# EAGLE design brainboard (EAGLE 5.10)
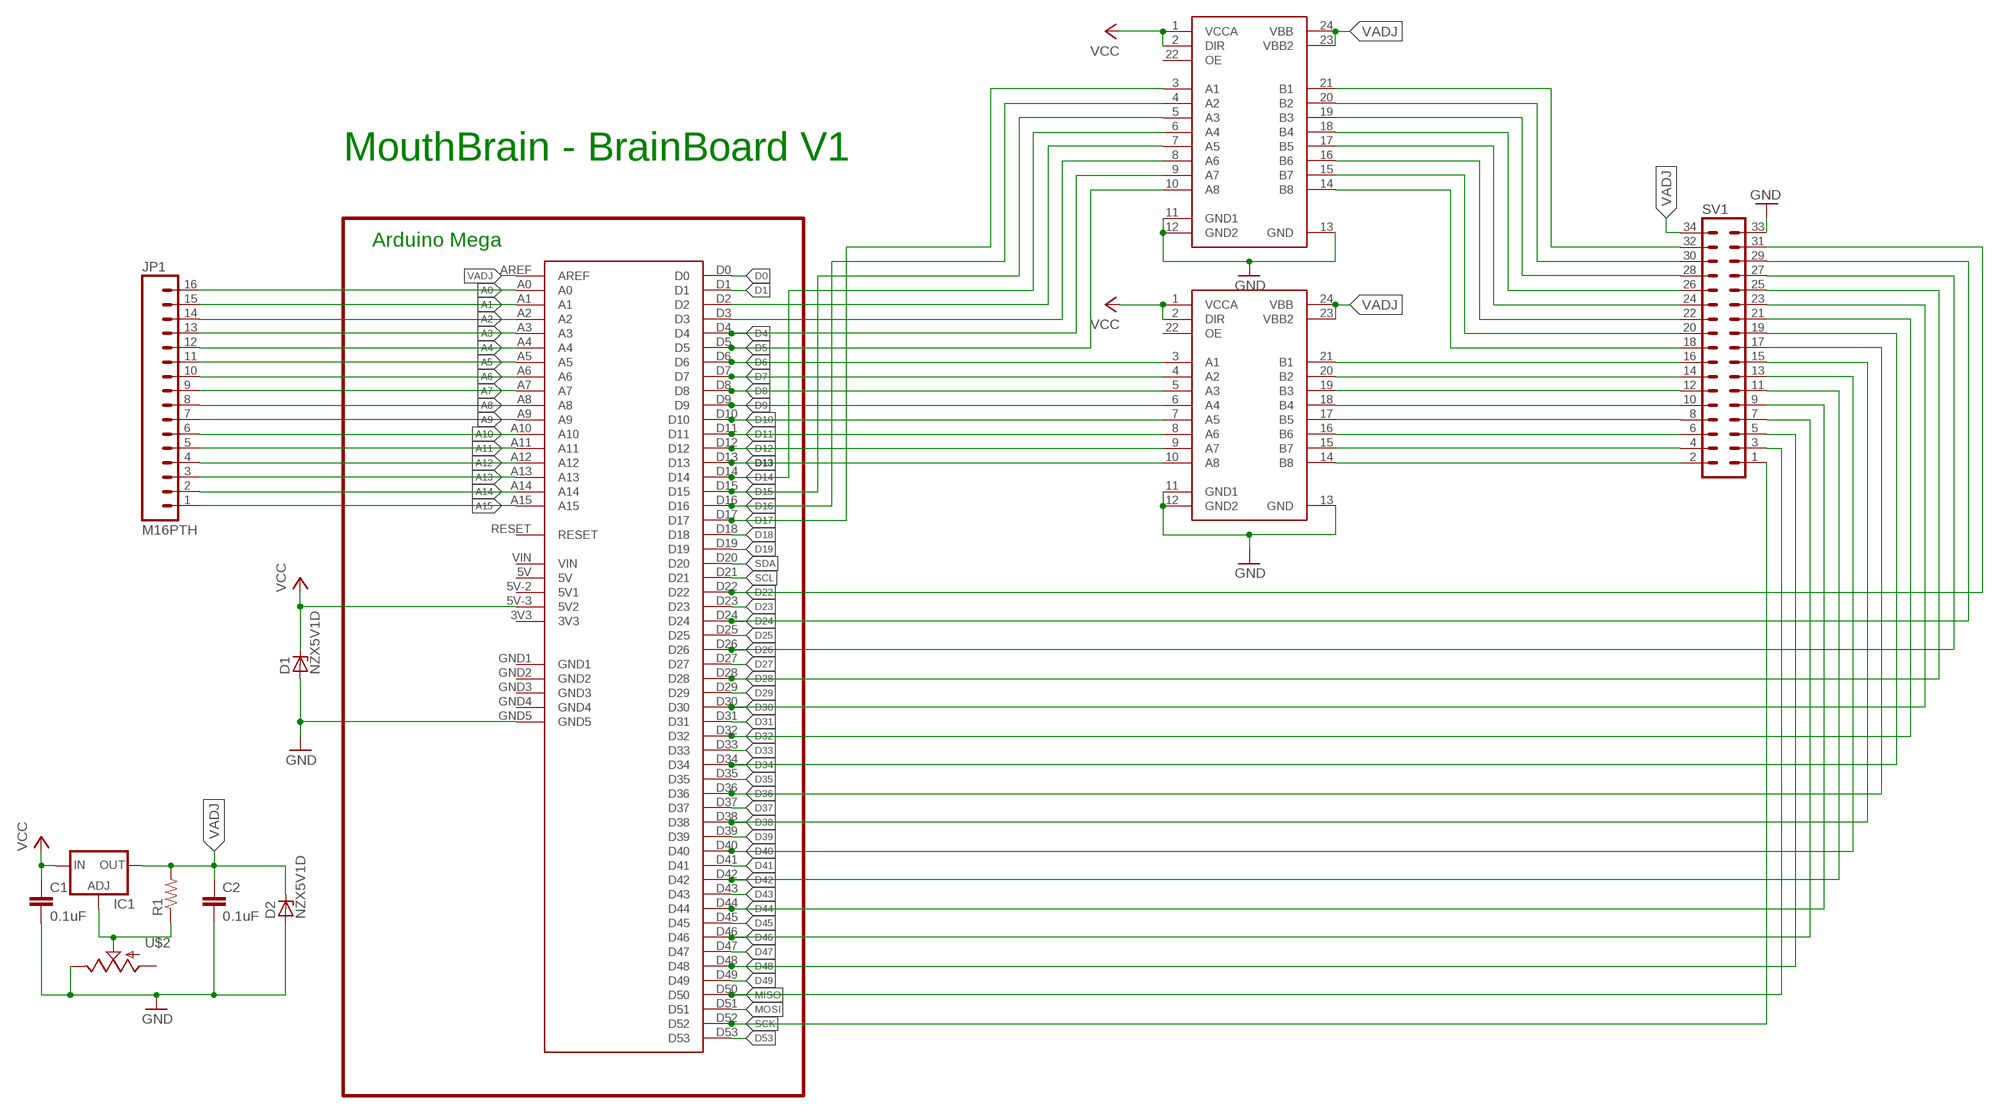
[diagram p0: schematic, sheet 1]

## Parts
C1  0.1uF  CAPPTH  [CAP-PTH-SMALL]
C2  0.1uF  CAPPTH  [CAP-PTH-SMALL]
D1  NZX5V1D  ZENER-DIODEDO34-7  [DO34Z7]
D2  NZX5V1D  ZENER-DIODEDO34-7  [DO34Z7]
DW1  SN74LVC8T245  [SO24W]
DW2  SN74LVC8T245  [SO24W]
IC1  LM317L  [317L]
JP1  M16PTH  [1X16]
R1  RESISTORPTH1  [AXIAL-0.3]
SV1  ML34  [ML34]
U$1  ARDUINO-MEGA  [ARDUINO-MEGA]
U$2  POTPTV09A-4  [PTV09A-4]

## Nets
A0: JP1.16 U$1.A0
A1: JP1.15 U$1.A1
A2: JP1.14 U$1.A2
A3: JP1.13 U$1.A3
A4: JP1.12 U$1.A4
A5: JP1.11 U$1.A5
A6: JP1.10 U$1.A6
A7: JP1.9 U$1.A7
A8: JP1.8 U$1.A8
A9: JP1.7 U$1.A9
A10: JP1.6 U$1.A10
A11: JP1.5 U$1.A11
A12: JP1.4 U$1.A12
A13: JP1.3 U$1.A13
A14: JP1.2 U$1.A14
A15: JP1.1 U$1.A15
D0: U$1.D0
D1: U$1.D1
D4: DW2.9(A7) U$1.D4
D5: DW2.10(A8) U$1.D5
D6: DW1.3(A1) U$1.D6
D7: DW1.4(A2) U$1.D7
D8: DW1.5(A3) U$1.D8
D9: DW1.6(A4) U$1.D9
D10: DW1.7(A5) U$1.D10
D11: DW1.8(A6) U$1.D11
D12: DW1.9(A7) U$1.D12
D13: DW1.10(A8) U$1.D13
D14: DW2.6(A4) U$1.D14
D15: DW2.5(A3) U$1.D15
D16: DW2.4(A2) U$1.D16
D17: DW2.3(A1) U$1.D17
D18: U$1.D18
D19: U$1.D19
D22: SV1.31 U$1.D22
D23: U$1.D23
D24: SV1.29 U$1.D24
D25: U$1.D25
D26: SV1.27 U$1.D26
D27: U$1.D27
D28: SV1.25 U$1.D28
D29: U$1.D29
D30: SV1.23 U$1.D30
D31: U$1.D31
D32: SV1.21 U$1.D32
D33: U$1.D33
D34: SV1.19 U$1.D34
D35: U$1.D35
D36: SV1.17 U$1.D36
D37: U$1.D37
D38: SV1.15 U$1.D38
D39: U$1.D39
D40: SV1.13 U$1.D40
D41: U$1.D41
D42: SV1.11 U$1.D42
D43: U$1.D43
D44: SV1.9 U$1.D44
D45: U$1.D45
D46: SV1.7 U$1.D46
D47: U$1.D47
D48: SV1.5 U$1.D48
D49: U$1.D49
D53: U$1.D53
GND: C1.2 C2.2 D1.A D2.A DW1.11(GND1) DW1.12(GND2) DW1.13(GND) DW2.11(GND1) DW2.12(GND2) DW2.13(GND) SV1.33 U$1.GND5 U$2.1(E)
MISO: SV1.3 U$1.D50
MOSI: U$1.D51
N$1: DW2.8(A6) U$1.D3
N$2: DW2.7(A5) U$1.D2
N$3: DW1.14(B8) SV1.2
N$4: IC1.1(ADJ) R1.P$1 U$2.2(S)
N$5: DW1.15(B7) SV1.4
N$6: DW1.16(B6) SV1.6
N$7: DW1.17(B5) SV1.8
N$8: DW2.14(B8) SV1.18
N$9: DW1.18(B4) SV1.10
N$10: DW1.19(B3) SV1.12
N$11: DW1.20(B2) SV1.14
N$12: DW2.15(B7) SV1.20
N$13: DW1.21(B1) SV1.16
N$14: DW2.16(B6) SV1.22
N$15: DW2.17(B5) SV1.24
N$16: DW2.18(B4) SV1.26
N$17: DW2.19(B3) SV1.28
N$18: DW2.20(B2) SV1.30
N$20: DW2.21(B1) SV1.32
SCK: SV1.1 U$1.D52
SCL: U$1.D21
SDA: U$1.D20
VADJ: C2.1 D2.C DW1.23(VBB2) DW1.24(VBB) DW2.23(VBB2) DW2.24(VBB) IC1.2(OUT) R1.P$2 SV1.34 U$1.AREF
VCC: C1.1 D1.C DW1.1(VCCA) DW1.2(DIR) DW2.1(VCCA) DW2.2(DIR) IC1.3(IN) U$1.5V-3(5V2)
Unconnected: DW1.22(OE) DW2.22(OE) U$1.3V3 U$1.5V U$1.5V-2(5V1) U$1.GND1 U$1.GND2 U$1.GND3 U$1.GND4 U$1.RESET U$1.VIN U$2.3(A)

## Notes on the sheet
- MouthBrain - BrainBoard V1
- Arduino Mega

## Library data of the parts
C1 C2 = SparkFun:CAP: Capacitor Standard 0603 ceramic capacitor, and 0.1" leaded capacitor.
D1 D2 = diode:ZENER-DIODE: Z-Diode
DW1 DW2 = Hoeken:SN74LVC8T245
IC1 = v-reg:LM317L: VOLTAGE REGULATOR
JP1 = SparkFun:M16
R1 = SparkFun:RESISTOR: Resistor Basic schematic elements and footprints for 0603, 1206, and PTH 1/10th watt (small) resistors.
SV1 = con-ml:ML34: HARTING
U$1 = MakerBot:ARDUINO-MEGA
U$2 = Hoeken:POT

## Net classes
0 default: width 0.254 mm, drill 0.508 mm, clearance 0.254 mm
1 power: width 0.61 mm, drill 0.711 mm, clearance 0.203 mm
2 gnd: width 0.305 mm, drill 0.711 mm, clearance 0.203 mm
3 usbvcc: width 0.508 mm, drill 0.711 mm, clearance 0.203 mm

## Board
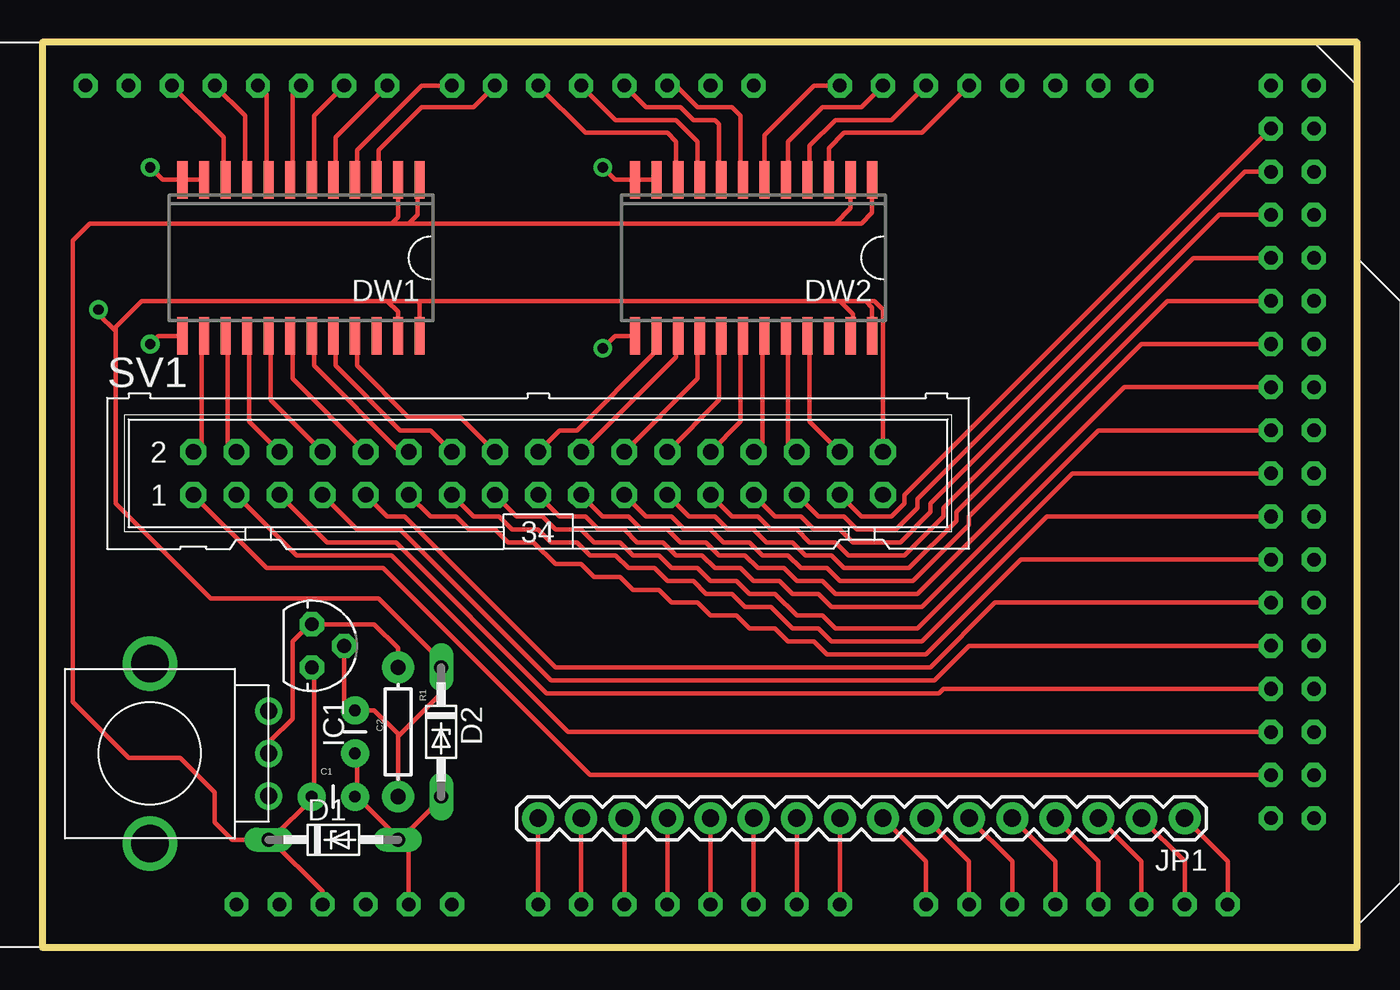
[diagram p1: board, top side]
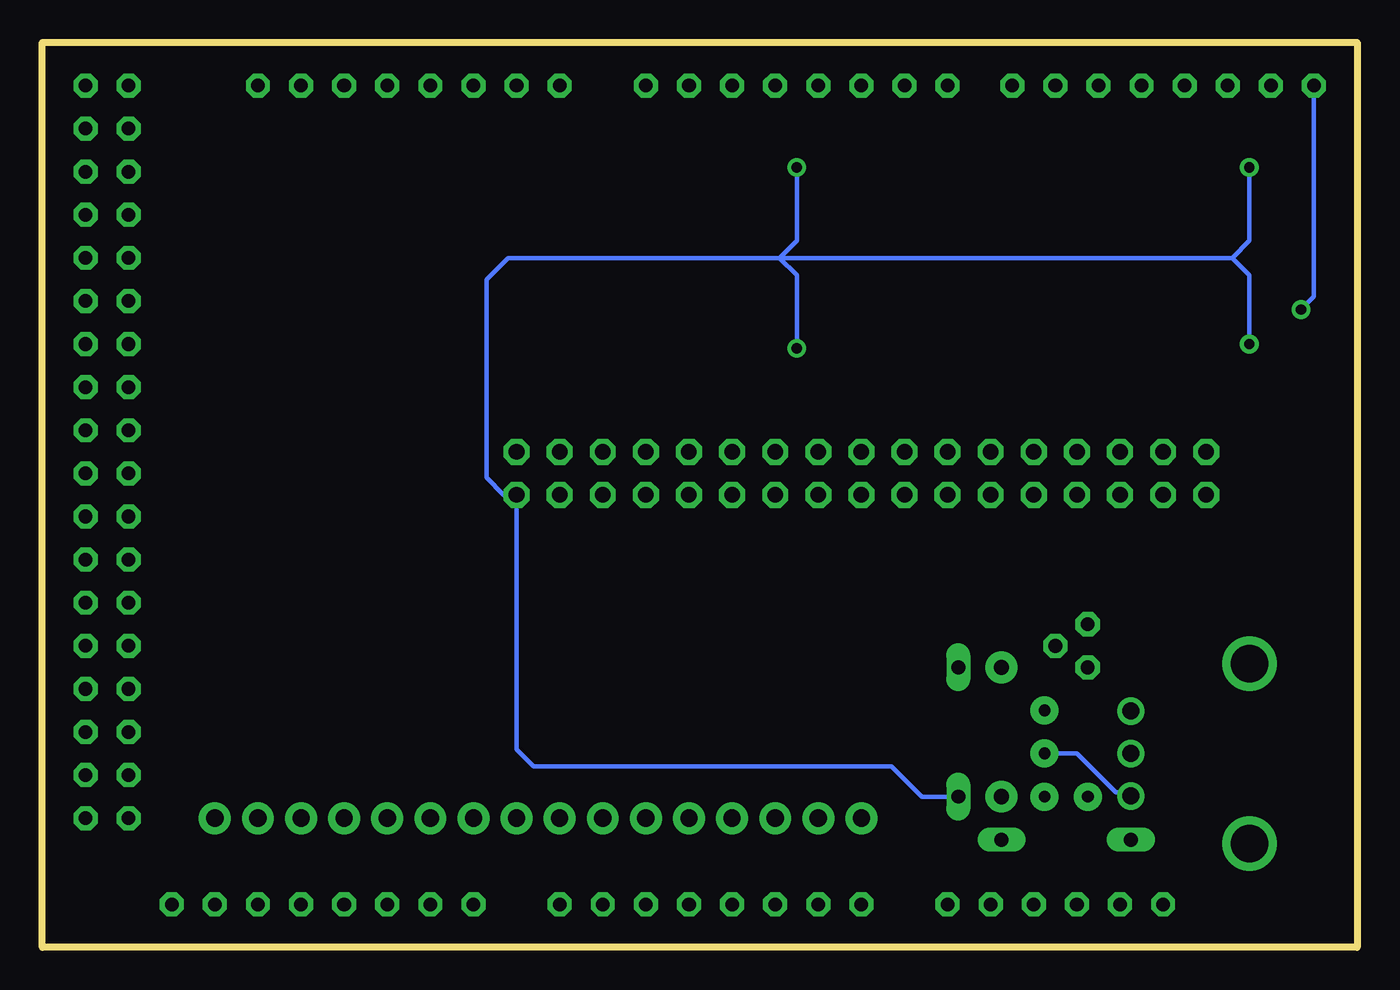
[diagram p2: board, bottom side, seen from below]

Size 77.47 x 53.34 mm. Coordinates in mm from the lower left corner, seen from the top.
Outline: 0,0 77.47,0 77.47,53.34 0,53.34 0,0
Copper layers (1*16): Top 0.035mm / dielectric 1.5mm / Bottom 0.035mm
Design rules "SparkFun *": minimum track width 8mil, minimum drill 20mil, track to track 12mil, track to pad 12mil, pad to pad 12mil, via to via 12mil, smd to smd 12mil, copper to edge 10mil, drill to drill 8mil, minimum pad ring 12mil, minimum via ring 10mil, stop-mask expansion 4mil, vias tented up to drill 25mil, thermal gap 10mil
tRestrict: area 73,7 to 74.3,51.4; area 8.3,27.3 to 50.2,28.6
bRestrict: area 8.3,27.3 to 50.2,28.6; area 73,7 to 74.3,51.4

### Footprints (pad centres in the part's own frame; a part is rotated, then mirrored left to right if it is on the bottom)
CAP-PTH-SMALL = drill 0.7 pad 1.651 round: 1 0,0; 2 2.54,0
DO34Z7 = drill 0.813 long: A 3.81,0; C -3.81,0
SO24W = smd 0.6 x 2.2: 1 -6.985,-4.6; 2 -5.715,-4.6; 3 -4.445,-4.6; 4 -3.175,-4.6; 5 -1.905,-4.6; 6 -0.635,-4.6; 7 0.635,-4.6; 8 1.905,-4.6; 9 3.175,-4.6; 10 4.445,-4.6; 11 5.715,-4.6; 12 6.985,-4.6; 13 6.985,4.6; 14 5.715,4.6; 15 4.445,4.6; 16 3.175,4.6; 17 1.905,4.6; 18 0.635,4.6; 19 -0.635,4.6; 20 -1.905,4.6; 21 -3.175,4.6; 22 -4.445,4.6; 23 -5.715,4.6; 24 -6.985,4.6
317L = drill 0.813 octagon: 1 -1.27,0; 2 0,1.905; 3 1.27,0
1X16 = drill 1.016 pad 1.88 round: 1 0,0; 2 2.54,0; 3 5.08,0; 4 7.62,0; 5 10.16,0; 6 12.7,0; 7 15.24,0; 8 17.78,0; 9 20.32,0; 10 22.86,0; 11 25.4,0; 12 27.94,0; 13 30.48,0; 14 33.02,0; 15 35.56,0; 16 38.1,0
AXIAL-0.3 = drill 0.9 pad 1.88 round: P$1 -3.81,0; P$2 3.81,0
ML34 = drill 0.914 octagon: 1 -20.32,-1.27; 2 -20.32,1.27; 3 -17.78,-1.27; 4 -17.78,1.27; 5 -15.24,-1.27; 6 -15.24,1.27; 7 -12.7,-1.27; 8 -12.7,1.27; 9 -10.16,-1.27; 10 -10.16,1.27; 11 -7.62,-1.27; 12 -7.62,1.27; 13 -5.08,-1.27; 14 -5.08,1.27; 15 -2.54,-1.27; 16 -2.54,1.27; 17 0,-1.27; 18 0,1.27; 19 2.54,-1.27; 20 2.54,1.27; 21 5.08,-1.27; 22 5.08,1.27; 23 7.62,-1.27; 24 7.62,1.27; 25 10.16,-1.27; 26 10.16,1.27; 27 12.7,-1.27; 28 12.7,1.27; 29 15.24,-1.27; 30 15.24,1.27; 31 17.78,-1.27; 32 17.78,1.27; 33 20.32,-1.27; 34 20.32,1.27
ARDUINO-MEGA = drill 0.8 octagon: 3V3 35.56,2.54; 5V 93.98,50.8; 5V-2 96.52,50.8; 5V-3 38.1,2.54; A0 50.8,2.54; A1 53.34,2.54; A2 55.88,2.54; A3 58.42,2.54; A4 60.96,2.54; A5 63.5,2.54; A6 66.04,2.54; A7 68.58,2.54; A8 73.66,2.54; A9 76.2,2.54; A10 78.74,2.54; A11 81.28,2.54; A12 83.82,2.54; A13 86.36,2.54; A14 88.9,2.54; A15 91.44,2.54; AREF 24.13,50.8; D0 63.5,50.8; D1 60.96,50.8; D2 58.42,50.8; D3 55.88,50.8; D4 53.34,50.8; D5 50.8,50.8; D6 48.26,50.8; D7 45.72,50.8; D8 41.91,50.8; D9 39.37,50.8; D10 36.83,50.8; D11 34.29,50.8; D12 31.75,50.8; D13 29.21,50.8; D14 68.58,50.8; D15 71.12,50.8; D16 73.66,50.8; D17 76.2,50.8; D18 78.74,50.8; D19 81.28,50.8; D20 83.82,50.8; D21 86.36,50.8; D22 93.98,48.26; D23 96.52,48.26; D24 93.98,45.72; D25 96.52,45.72; D26 93.98,43.18; D27 96.52,43.18; D28 93.98,40.64; D29 96.52,40.64; D30 93.98,38.1; D31 96.52,38.1; D32 93.98,35.56; D33 96.52,35.56; D34 93.98,33.02; D35 96.52,33.02; D36 93.98,30.48; D37 96.52,30.48; D38 93.98,27.94; D39 96.52,27.94; D40 93.98,25.4; D41 96.52,25.4; D42 93.98,22.86; D43 96.52,22.86; D44 93.98,20.32; D45 96.52,20.32; D46 93.98,17.78; D47 96.52,17.78; D48 93.98,15.24; D49 96.52,15.24; D50 93.98,12.7; D51 96.52,12.7; D52 93.98,10.16; D53 96.52,10.16; GND1 26.67,50.8; GND2 93.98,7.62; GND3 96.52,7.62; GND4 40.64,2.54; GND5 43.18,2.54; RESET 33.02,2.54; VIN 45.72,2.54
PTV09A-4 = drill 1 round: 1 -2.5,0; 2 0,0; 3 2.5,0 | drill 2.2 round: P$4 5.3,7; P$5 -5.3,7

### Placement (x,y rotation side)
C1  15.88,8.89 0 top
C2  18.41,13.97 270 top
D1  17.14,6.35 0 top
D2  23.49,12.7 270 top
DW1  15.24,40.64 180 top
DW2  41.91,40.64 180 top
IC1  15.88,17.78 270 top
JP1  67.31,7.62 180 top
R1  20.95,12.7 270 top
SV1  29.21,27.94 0 top
U$1  -21.59,0 0 top
U$2  13.34,11.43 90 top

### Tracks (layer width: path | path; a pad name or v marks a point on that pad's centre or on a via)
A0
  Top 0.254: U$1.A0 JP1.16
A1
  Top 0.254: U$1.A1 JP1.15
A2
  Top 0.254: U$1.A2 JP1.14
A3
  Top 0.254: U$1.A3 JP1.13
A4
  Top 0.254: U$1.A4 JP1.12
A5
  Top 0.254: U$1.A5 JP1.11
A6
  Top 0.254: U$1.A6 JP1.10
A7
  Top 0.254: U$1.A7 JP1.9
A8
  Top 0.254: U$1.A8 52.07,5.08 JP1.8
A9
  Top 0.254: U$1.A9 54.61,5.08 JP1.7
A10
  Top 0.254: U$1.A10 57.15,5.08 JP1.6
A11
  Top 0.254: U$1.A11 59.69,5.08 JP1.5
A12
  Top 0.254: U$1.A12 62.23,5.08 JP1.4
A13
  Top 0.254: U$1.A13 64.77,5.08 JP1.3
A14
  Top 0.254: U$1.A14 67.31,5.08 JP1.2
A15
  Top 0.254: U$1.A15 69.85,5.08 JP1.1
D4
  Top 0.254: U$1.D4 33.78,48.77 37.34,48.77 38.61,47.5 38.61,45.47 DW2.9
D5
  Top 0.254: U$1.D5 32,48.01 36.83,48.01 37.34,47.5 37.34,45.47 DW2.10
D6
  Top 0.254: U$1.D6 25.4,49.53 22.35,49.53 19.81,46.99 19.81,44.7 DW1.3
D7
  Top 0.254: DW1.4 18.54,44.7 18.54,46.99 22.35,50.8 U$1.D7
D8
  Top 0.254: U$1.D8 17.27,47.75 17.27,44.7 DW1.5
D9
  Top 0.254: U$1.D9 16,49.02 16,44.7 DW1.6
D10
  Top 0.254: U$1.D10 14.73,50.29 14.73,44.7 DW1.7
D11
  Top 0.254: U$1.D11 13.21,50.29 13.21,44.7 DW1.8
D12
  Top 0.254: U$1.D12 11.94,49.02 11.94,44.7 DW1.9
D13
  Top 0.254: U$1.D13 10.67,47.75 10.67,44.7 DW1.10
D14
  Top 0.254: DW2.6 42.55,47.88 45.47,50.8 U$1.D14
D15
  Top 0.254: U$1.D15 48.26,49.53 45.97,49.53 43.94,47.5 43.94,45.47 DW2.5
D16
  Top 0.254: U$1.D16 50.04,48.77 46.74,48.77 45.21,47.24 45.21,45.47 DW2.4
D17
  Top 0.254: U$1.D17 51.82,48.01 47.24,48.01 46.35,47.12 DW2.3
D22
  Top 0.254: U$1.D22 50.8,26.67 50.8,26.16 50.04,25.4 48.26,25.4 SV1.31
D24
  Top 0.254: U$1.D24 70.87,45.72 51.56,26.42 51.56,25.91 50.29,24.64 48.01,24.64 47.24,25.4 45.72,25.4 SV1.29
D26
  Top 0.254: U$1.D26 69.34,43.18 52.32,26.16 52.32,25.65 50.55,23.88 47.75,23.88 46.99,24.64 45.47,24.64 44.7,25.4 43.18,25.4 SV1.27
D28
  Top 0.254: U$1.D28 67.82,40.64 53.09,25.91 53.09,25.4 50.8,23.11 47.5,23.11 46.74,23.88 45.21,23.88 44.45,24.64 42.93,24.64 42.16,25.4 40.64,25.4 SV1.25
D30
  Top 0.254: U$1.D30 66.29,38.1 53.85,25.65 53.85,25.15 51.05,22.35 47.24,22.35 46.48,23.11 44.96,23.11 44.2,23.88 42.67,23.88 41.91,24.64 40.39,24.64 39.62,25.4 38.1,25.4 SV1.23
D32
  Top 0.254: U$1.D32 64.77,35.56 54.61,25.4 54.61,24.89 51.31,21.59 46.99,21.59 46.23,22.35 44.7,22.35 43.94,23.11 42.42,23.11 41.66,23.88 40.13,23.88 39.37,24.64 37.85,24.64 37.08,25.4 35.56,25.4 SV1.21
D34
  Top 0.254: U$1.D34 63.75,33.02 51.56,20.83 46.74,20.83 45.97,21.59 44.45,21.59 43.69,22.35 42.16,22.35 41.4,23.11 39.88,23.11 39.12,23.88 37.59,23.88 36.83,24.64 35.31,24.64 34.54,25.4 33.02,25.4 SV1.19
D36
  Top 0.254: U$1.D36 62.23,30.48 51.82,20.07 46.48,20.07 45.72,20.83 44.2,20.83 43.43,21.59 41.91,21.59 41.15,22.35 39.62,22.35 38.86,23.11 37.34,23.11 36.58,23.88 35.05,23.88 34.29,24.64 32.77,24.64 32,25.4 30.48,25.4 SV1.17
D38
  Top 0.254: U$1.D38 60.71,27.94 51.56,18.8 46.74,18.8 45.97,19.56 44.45,19.56 43.18,20.83 41.66,20.83 40.89,21.59 39.37,21.59 38.61,22.35 37.08,22.35 36.32,23.11 34.8,23.11 34.04,23.88 32.51,23.88 31.75,24.64 30.23,24.64 29.46,25.4 27.94,25.4 SV1.15
D40
  Top 0.254: U$1.D40 59.18,25.4 51.82,18.03 46.48,18.03 45.72,18.8 44.2,18.8 42.93,20.07 41.4,20.07 40.64,20.83 39.12,20.83 38.35,21.59 36.83,21.59 36.07,22.35 34.54,22.35 33.78,23.11 32.26,23.11 31.5,23.88 29.97,23.88 29.21,24.64 27.69,24.64 26.92,25.4 25.4,25.4 SV1.13
D42
  Top 0.254: U$1.D42 57.66,22.86 52.07,17.27 46.23,17.27 45.47,18.03 43.94,18.03 43.18,18.8 41.66,18.8 40.89,19.56 39.37,19.56 38.61,20.32 37.08,20.32 36.32,21.08 34.8,21.08 34.04,21.84 32.51,21.84 31.75,22.61 30.23,22.61 28.96,23.88 27.43,23.88 26.67,24.64 25.15,24.64 24.38,25.4 22.86,25.4 SV1.11
D44
  Top 0.254: U$1.D44 56.13,20.32 52.32,16.51 30.23,16.51 21.34,25.4 20.32,25.4 SV1.9
D46
  Top 0.254: U$1.D46 54.61,17.78 52.58,15.75 29.97,15.75 21.08,24.64 18.54,24.64 SV1.7
D48
  Top 0.254: U$1.D48 53.09,15.24 52.83,14.99 29.72,14.99 20.83,23.88 16.76,23.88 SV1.5
GND  (via drill 0.6)
  Top 0.254: 18.54,8.89 18.54,11.43 C2.2 | U$1.GND5 21.59,5.84 21.08,6.35 | 21.08,6.35 23.37,8.64 23.37,10.16 D2.A | 18.54,8.89 21.08,6.35 | 18.54,8.89 C1.2 | 21.08,6.35 D1.A | DW1.13 6.83,36.04 v6.35,35.56 | v33.02,45.97 33.75,45.24 DW2.12 DW2.11 | DW2.13 33.75,36.04 v33.02,35.31 | v6.35,45.97 7.08,45.24 DW1.12 DW1.11
  Bottom 0.254: U$2.1 13.46,9.14 14.22,9.14 16.51,11.43 C2.2 | 34.04,40.64 50.04,40.64 51.31,39.37 51.31,27.69 50.29,26.67 SV1.33 49.53,11.68 48.51,10.67 27.43,10.67 25.65,8.89 D2.A | 34.04,40.64 7.37,40.64 | v33.02,45.97 33.02,41.66 34.04,40.64 | v33.02,35.31 33.02,39.62 34.04,40.64 | v6.35,35.56 6.35,39.62 7.37,40.64 | v6.35,45.97 6.35,41.66 7.37,40.64
MISO
  Top 0.254: U$1.D50 30.99,12.7 20.57,23.11 14.99,23.11 SV1.3
N$1
  Top 0.254: U$1.D3 35.56,49.53 37.59,49.53 38.35,48.77 39.62,48.77 39.88,48.51 39.88,45.47 DW2.8
N$2
  Top 0.254: DW2.7 41.15,45.47 41.15,49.02 40.64,49.53 38.61,49.53 37.34,50.8 U$1.D2
N$3
  Top 0.254: SV1.2 9.4,29.72 9.4,35.31 DW1.14
N$4
  Top 0.254: U$2.2 13.46,11.43 13.46,12.19 14.73,13.46 14.73,18.03 15.75,19.05 IC1.1 19.56,19.05 20.95,17.65 R1.P$1
N$5
  Top 0.254: SV1.4 10.92,29.72 10.92,35.31 DW1.15
N$6
  Top 0.254: SV1.6 12.19,30.99 12.19,35.31 DW1.16
N$7
  Top 0.254: SV1.8 13.46,32.26 13.46,35.31 DW1.17
N$8
  Top 0.254: SV1.18 30.48,30.48 31.5,30.48 36.07,35.05 36.07,35.81 DW2.14
N$9
  Top 0.254: SV1.10 14.73,33.53 14.73,35.31 DW1.18
N$10
  Top 0.254: SV1.12 21.08,29.21 16,34.29 16,35.31 DW1.19
N$11
  Top 0.254: SV1.14 22.86,30.48 21.08,30.48 17.27,34.29 17.27,35.31 DW1.20
N$12
  Top 0.254: SV1.20 37.34,34.8 37.34,35.81 DW2.15
N$13
  Top 0.254: SV1.16 24.64,31.24 21.59,31.24 18.54,34.29 18.54,35.31 DW1.21
N$14
  Top 0.254: SV1.22 38.61,33.53 38.61,35.81 DW2.16
N$15
  Top 0.254: SV1.24 39.88,32.26 39.88,35.81 DW2.17
N$16
  Top 0.254: SV1.26 41.15,30.99 41.15,35.81 DW2.18
N$17
  Top 0.254: SV1.28 42.42,29.72 42.42,35.81 DW2.19
N$18
  Top 0.254: SV1.30 43.94,29.72 43.94,35.81 DW2.20
N$20
  Top 0.254: SV1.32 45.21,30.99 45.21,35.81 DW2.21
SCK
  Top 0.254: U$1.D52 32.26,10.16 20.07,22.35 13.21,22.35 SV1.1
VADJ  (via drill 0.6)
  Top 0.254: IC1.2 17.78,14.48 18.29,13.97 C2.1 19.56,13.97 20.95,12.57 20.95,12.45 | DW2.23 47.75,36.07 47.75,37.34 46.99,38.1 | 48.77,36.07 DW2.24 48.89,37.72 48.51,38.1 | 4.32,36.32 4.32,26.16 9.91,20.57 19.81,20.57 23.49,16.89 D2.C 23.37,16.51 23.37,14.86 20.95,12.45 | 4.32,36.32 4.32,36.58 5.84,38.1 20.32,38.1 | 20.32,38.1 22.1,38.1 | 22.1,38.1 46.99,38.1 | 46.99,38.1 48.51,38.1 | 48.51,38.1 49.02,38.1 49.53,37.59 SV1.34 | DW1.24 22.22,37.97 22.1,38.1 | DW1.23 20.95,37.46 20.32,38.1 | v3.3,37.59 3.3,37.34 4.32,36.32 | R1.P$2 20.95,12.45
  Bottom 0.254: U$1.AREF 2.54,38.35 v3.3,37.59
VCC
  Top 0.254: U$1.5V-3 16.51,3.3 13.46,6.35 | 16,8.89 16,16.51 IC1.3 | 13.46,6.35 16,8.89 | 13.46,6.35 D1.C 11.18,6.35 10.16,7.37 10.16,9.14 8.13,11.18 5.08,11.18 1.78,14.48 1.78,41.66 2.79,42.67 20.57,42.67 | 16,8.89 C1.1 | 21.08,44.7 DW1.2 20.95,43.05 20.57,42.67 | DW1.1 22.1,44.7 22.1,43.18 21.59,42.67 | 47.75,45.21 DW2.2 47.62,43.56 46.74,42.67 | DW2.1 48.89,43.31 48.26,42.67 46.74,42.67 | 20.57,42.67 21.59,42.67 | 21.59,42.67 46.74,42.67